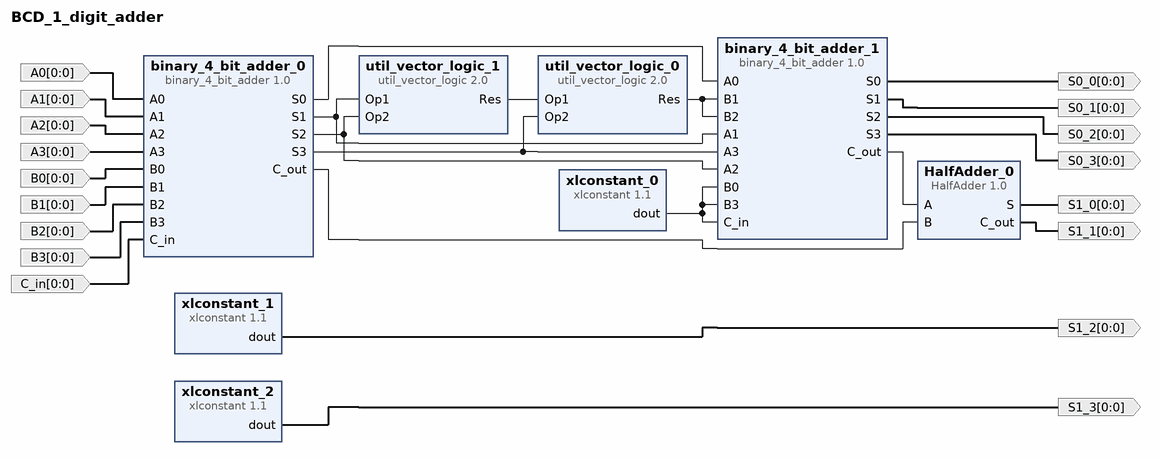
[diagram p0: block diagram of the top level]
# Vivado block design BCD_1_digit_adder, xc7vx485tffg1157-1, Vivado 2019.1
create_bd_design BCD_1_digit_adder

create_bd_port -dir I -from 0 -to 0 A0
create_bd_port -dir I -from 0 -to 0 A1
create_bd_port -dir I -from 0 -to 0 A2
create_bd_port -dir I -from 0 -to 0 A3
create_bd_port -dir I -from 0 -to 0 B0
create_bd_port -dir I -from 0 -to 0 B1
create_bd_port -dir I -from 0 -to 0 B2
create_bd_port -dir I -from 0 -to 0 B3
create_bd_port -dir I -from 0 -to 0 C_in
create_bd_port -dir O -from 0 -to 0 S0_0
create_bd_port -dir O -from 0 -to 0 S0_1
create_bd_port -dir O -from 0 -to 0 S0_2
create_bd_port -dir O -from 0 -to 0 S0_3
create_bd_port -dir O -from 0 -to 0 S1_0
create_bd_port -dir O -from 0 -to 0 S1_1
create_bd_port -dir O -from 0 -to 0 S1_2
create_bd_port -dir O -from 0 -to 0 S1_3

create_bd_cell -type ip -vlnv Group5:user:HalfAdder:1.0 HalfAdder_0
create_bd_cell -type ip -vlnv xilinx.com:ip:util_vector_logic:2.0 util_vector_logic_0
create_bd_cell -type ip -vlnv xilinx.com:ip:util_vector_logic:2.0 util_vector_logic_1
set_property -dict {CONFIG.C_OPERATION or} [get_bd_cells util_vector_logic_1]
create_bd_cell -type ip -vlnv xilinx.com:ip:xlconstant:1.1 xlconstant_0
set_property -dict {CONFIG.CONST_VAL 0} [get_bd_cells xlconstant_0]
create_bd_cell -type ip -vlnv xilinx.com:ip:xlconstant:1.1 xlconstant_1
set_property -dict {CONFIG.CONST_VAL 0} [get_bd_cells xlconstant_1]
create_bd_cell -type ip -vlnv xilinx.com:ip:xlconstant:1.1 xlconstant_2
set_property -dict {CONFIG.CONST_VAL 0} [get_bd_cells xlconstant_2]
create_bd_cell -type ip -vlnv Group5:user:binary_4_bit_adder:1.0 binary_4_bit_adder_0
create_bd_cell -type ip -vlnv Group5:user:binary_4_bit_adder:1.0 binary_4_bit_adder_1

# ---- connections ----

connect_bd_net -net A0_1 [get_bd_ports A0] [get_bd_pins binary_4_bit_adder_0/A0]
connect_bd_net -net A1_1 [get_bd_ports A1] [get_bd_pins binary_4_bit_adder_0/A1]
connect_bd_net -net A2_1 [get_bd_ports A2] [get_bd_pins binary_4_bit_adder_0/A2]
connect_bd_net -net A3_1 [get_bd_ports A3] [get_bd_pins binary_4_bit_adder_0/A3]
connect_bd_net -net B0_1 [get_bd_ports B0] [get_bd_pins binary_4_bit_adder_0/B0]
connect_bd_net -net B1_1 [get_bd_ports B1] [get_bd_pins binary_4_bit_adder_0/B1]
connect_bd_net -net B2_1 [get_bd_ports B2] [get_bd_pins binary_4_bit_adder_0/B2]
connect_bd_net -net B3_1 [get_bd_ports B3] [get_bd_pins binary_4_bit_adder_0/B3]
connect_bd_net [get_bd_ports C_in] [get_bd_pins binary_4_bit_adder_0/C_in]
connect_bd_net [get_bd_pins HalfAdder_0/C_out] [get_bd_ports S1_1]
connect_bd_net [get_bd_pins HalfAdder_0/S] [get_bd_ports S1_0]
connect_bd_net [get_bd_pins binary_4_bit_adder_0/C_out] [get_bd_pins HalfAdder_0/B]
connect_bd_net [get_bd_pins binary_4_bit_adder_0/S0] [get_bd_pins binary_4_bit_adder_1/A0]
connect_bd_net [get_bd_pins binary_4_bit_adder_0/S1] [get_bd_pins util_vector_logic_1/Op1] [get_bd_pins binary_4_bit_adder_1/A1]
connect_bd_net [get_bd_pins binary_4_bit_adder_0/S2] [get_bd_pins util_vector_logic_1/Op2] [get_bd_pins binary_4_bit_adder_1/A2]
connect_bd_net [get_bd_pins binary_4_bit_adder_0/S3] [get_bd_pins util_vector_logic_0/Op2] [get_bd_pins binary_4_bit_adder_1/A3]
connect_bd_net [get_bd_pins binary_4_bit_adder_1/C_out] [get_bd_pins HalfAdder_0/A]
connect_bd_net [get_bd_pins binary_4_bit_adder_1/S0] [get_bd_ports S0_0]
connect_bd_net [get_bd_pins binary_4_bit_adder_1/S1] [get_bd_ports S0_1]
connect_bd_net [get_bd_pins binary_4_bit_adder_1/S2] [get_bd_ports S0_2]
connect_bd_net [get_bd_pins binary_4_bit_adder_1/S3] [get_bd_ports S0_3]
connect_bd_net [get_bd_pins util_vector_logic_0/Res] [get_bd_pins binary_4_bit_adder_1/B1] [get_bd_pins binary_4_bit_adder_1/B2]
connect_bd_net [get_bd_pins util_vector_logic_1/Res] [get_bd_pins util_vector_logic_0/Op1]
connect_bd_net [get_bd_pins xlconstant_0/dout] \
  [get_bd_pins binary_4_bit_adder_1/B0] [get_bd_pins binary_4_bit_adder_1/B3] [get_bd_pins binary_4_bit_adder_1/C_in]
connect_bd_net [get_bd_pins xlconstant_1/dout] [get_bd_ports S1_2]
connect_bd_net [get_bd_pins xlconstant_2/dout] [get_bd_ports S1_3]

validate_bd_design
save_bd_design
